# Altium schematic sheet ADC_schematic.SchDoc
size A
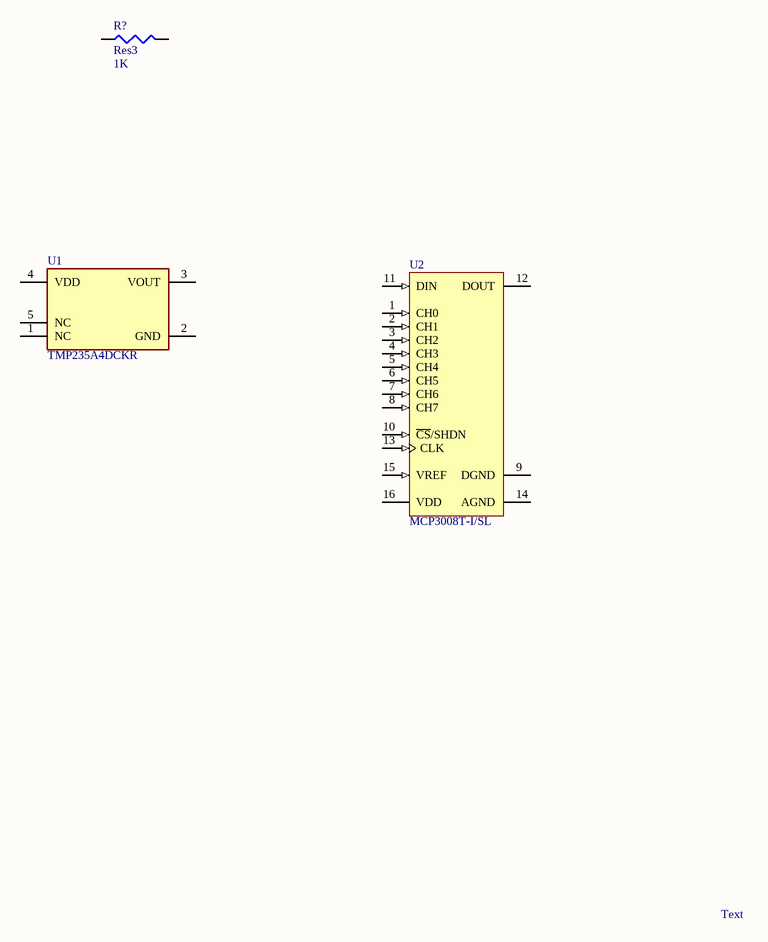
[diagram p0: ADC_schematic.SchDoc]

## Parts
R?  Res3  value 1K  [J1-0603]
U1  TMP235A4DCKR  [FP-DCK0005A-MFG]
U2  MCP3008T-I/SL  [SOIC-SL16_N]

## Nets

Not connected (* = marked no-connect by the designer): R? 1 2; U1 1(NC) 2(GND) 3(VOUT) 4(VDD) 5(NC); U2 1(CH0) 2(CH1) 3(CH2) 4(CH3) 5(CH4) 6(CH5) 7(CH6) 8(CH7) 9(DGND) 10(~{CS}/SHDN) 11(DIN) 12(DOUT) 13(CLK) 14(AGND) 15(VREF) 16(VDD)

## Notes on the sheet
- Text

## Library data of the parts
R? = Res3: Resistor; Published: 8-Jun-2000; LatestRevisionDate: 29-May-2009; LatestRevisionNote: IPC-7351 Footprint Added.; PackageReference: J1-0603; Publisher: Altium Limited; PackageDescription: Chip Resistor
U1 = CMP-04948-000022-1: SENSOR ANALOG -40C-150C SC70-5; Manufacturer: Texas Instruments; Max Junction Temp: +150°C; Output Current: 500uA; Standoff Height: 0mm; Output Voltage: 100-2000mV; Operating Supply Current: 9-10uA; Min Supply Voltage: 2.3V; Sensor Output: Analog Voltage; Max Supply Voltage: 5.5V; Ambient Temperature Range High: +150°C; Manufacturer Part Number: TMP235A4DCKR; Temperature Range Low: -40°C; Temperature Range High: +150°C; Lead Free: Yes; Mouser Description: ±2.5°C Analog output temperature sensor, with 10mV /°C gain 5-SC70 -40 to 150; Height: 1.1mm; ComponentLink2Description: Datasheet; ComponentLink2URL: https://www.ti.com/lit/ds/symlink/tmp235.pdf; Device Class L1: Sensors; Ambient Temperature Range Low: -40°C; Temperature: -40°C to +150°C; Device Class L2: Temperature and Humidity Sensors; Category: IC; Digikey Description: SENSOR ANALOG -40C-150C SC70-5; Automotive: No; RoHS: TRUE; Device Class L3: unset; Package: DCK0005A; Octopart: https://octopart.com/tmp235a4dckr-texas+instruments-88184449
U2 = CMP-0188-00351-2: 2.7V 4-Channel/8-Channel 10-Bit A/D Converters with SPI Serial Interface, 16-Pin SOIC 150mil, Industrial Temperature, Tape and Reel; ComponentLink2Description: Datasheet; Code_JEDEC: MS-012-AC; Code_IPC: SOIC127P600-16; ComponentLink1Description: Manufacturer URL; DatasheetVersion: revD, Dec-2008; PackageReference: SOIC-SL16; ComponentLink2URL: http://ww1.microchip.com/downloads/en/DeviceDoc/21295d.pdf; ComponentLink3Description: Package Specification; ComponentLink3URL: http://www.microchip.com/stellent/groups/techpub_sg/documents/packagingspec/en012702.pdf; PackageVersion: revBB, Aug-2009; RevisionNote: URLs added.; PackageDescription: 16-Lead Plastic Small Outline (SL) - Narrow, 3.90mm Body [SOIC]; ComponentLink1URL: http://www.microchip.com/